# Altium schematic sheet 点阵.SchDoc
size A4
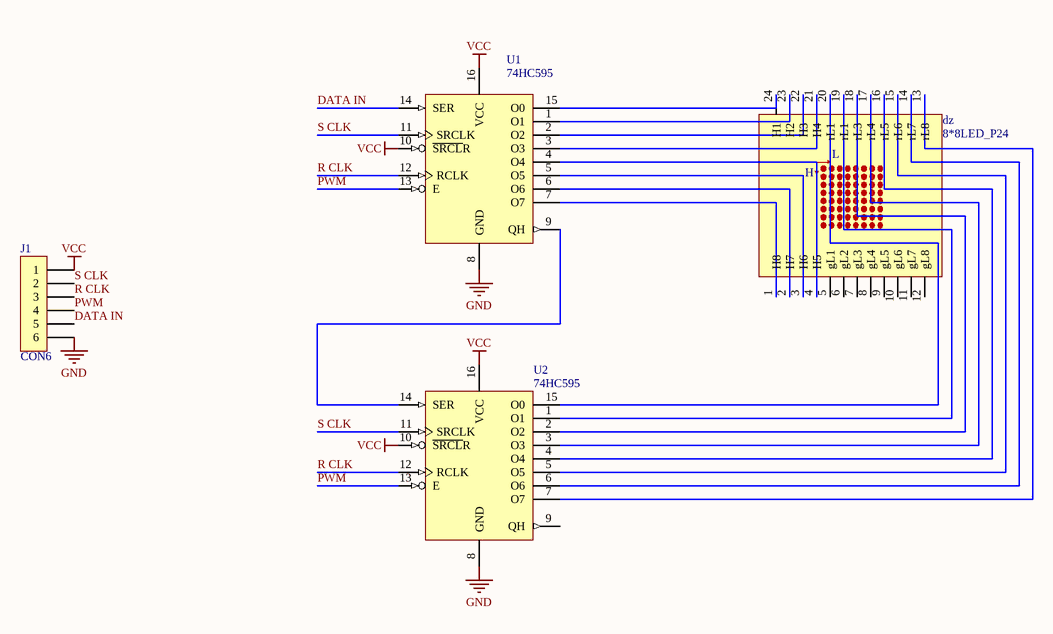
[diagram p0: 点阵.SchDoc]

## Parts
dz  8*8LED_P24  [双色点阵]
J1  CON6  [sip-6]
U1  74HC595  [DIP-16]
U2  74HC595  [DIP-16]

## Nets
GND: J1.6 U1.8(GND) U2.8(GND)
VCC: J1.1 U1.10(~{SRCL}R) U1.16(VCC) U2.10(~{SRCL}R) U2.16(VCC)
DATA IN: J1.5 U1.14(SER)
PWM: J1.4 U1.13(E) U2.13(E)
R CLK: J1.3 U1.12(RCLK) U2.12(RCLK)
S CLK: J1.2 U1.11(SRCLK) U2.11(SRCLK)
Netdz_1: dz.1(H8) U1.7(O7)
Netdz_2: dz.2(H7) U1.6(O6)
Netdz_3: dz.3(H6) U1.5(O5)
Netdz_4: dz.4(H5) U1.4(O4)
Netdz_13: dz.13(rL8) U2.7(O7)
Netdz_14: dz.14(rL7) U2.6(O6)
Netdz_15: dz.15(rL6) U2.5(O5)
Netdz_16: dz.16(rL5) U2.4(O4)
Netdz_17: dz.17(rL4) U2.3(O3)
Netdz_18: dz.18(rL3) U2.2(O2)
Netdz_19: dz.19(rL1) U2.1(O1)
Netdz_20: dz.20(rL1) U2.15(O0)
Netdz_21: dz.21(H4) U1.3(O3)
Netdz_22: dz.22(H3) U1.2(O2)
Netdz_23: dz.23(H2) U1.1(O1)
Netdz_24: dz.24(H1) U1.15(O0)
NetU1_9: U1.9(QH) U2.14(SER)

Not connected (* = marked no-connect by the designer): dz 5(gL1) 6(gL2) 7(gL3) 8(gL4) 9(gL5) 10(gL6) 11(gL7) 12(gL8); U2 9(QH)

## Notes on the sheet
- (in symbol 8*8LED_P24) L; H

## Library data of the parts
dz = 8*8LED_P24: 型号: D03885（单色），RX1588ASRG、HC1588BSG(双色共阳); 型号: JZM15880AGR; 视图说明: 管脚平行放置，型号朝下
J1 = CON6: Connector